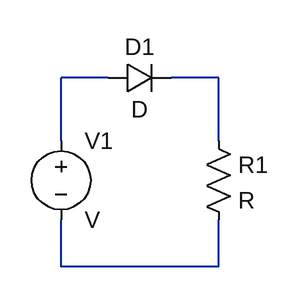
[diagram p0: schematic Draft2.asc]
Draft2.asc, the LTspice schematic file:
Version 4.1
SHEET 1 880 680
WIRE 32 160 -16 160
WIRE 144 160 96 160
WIRE -16 224 -16 160
WIRE 144 224 144 160
WIRE -16 352 -16 304
WIRE 144 352 144 304
WIRE 144 352 -16 352
SYMBOL voltage -16 208 R0
SYMATTR InstName V1
SYMBOL res 128 208 R0
SYMATTR InstName R1
SYMBOL diode 32 176 R270
WINDOW 0 32 32 VTop 2
WINDOW 3 0 32 VBottom 2
SYMATTR InstName D1

The netlist it stands for:
* Draft2.asc
V1 N001 N003 V
R1 N002 N003 R
D1 N001 N002 D
.model D D
.lib standard.dio
.backanno
.end